# EAGLE design LorenzoSchematicnewtrace (EAGLE 8.7.1)
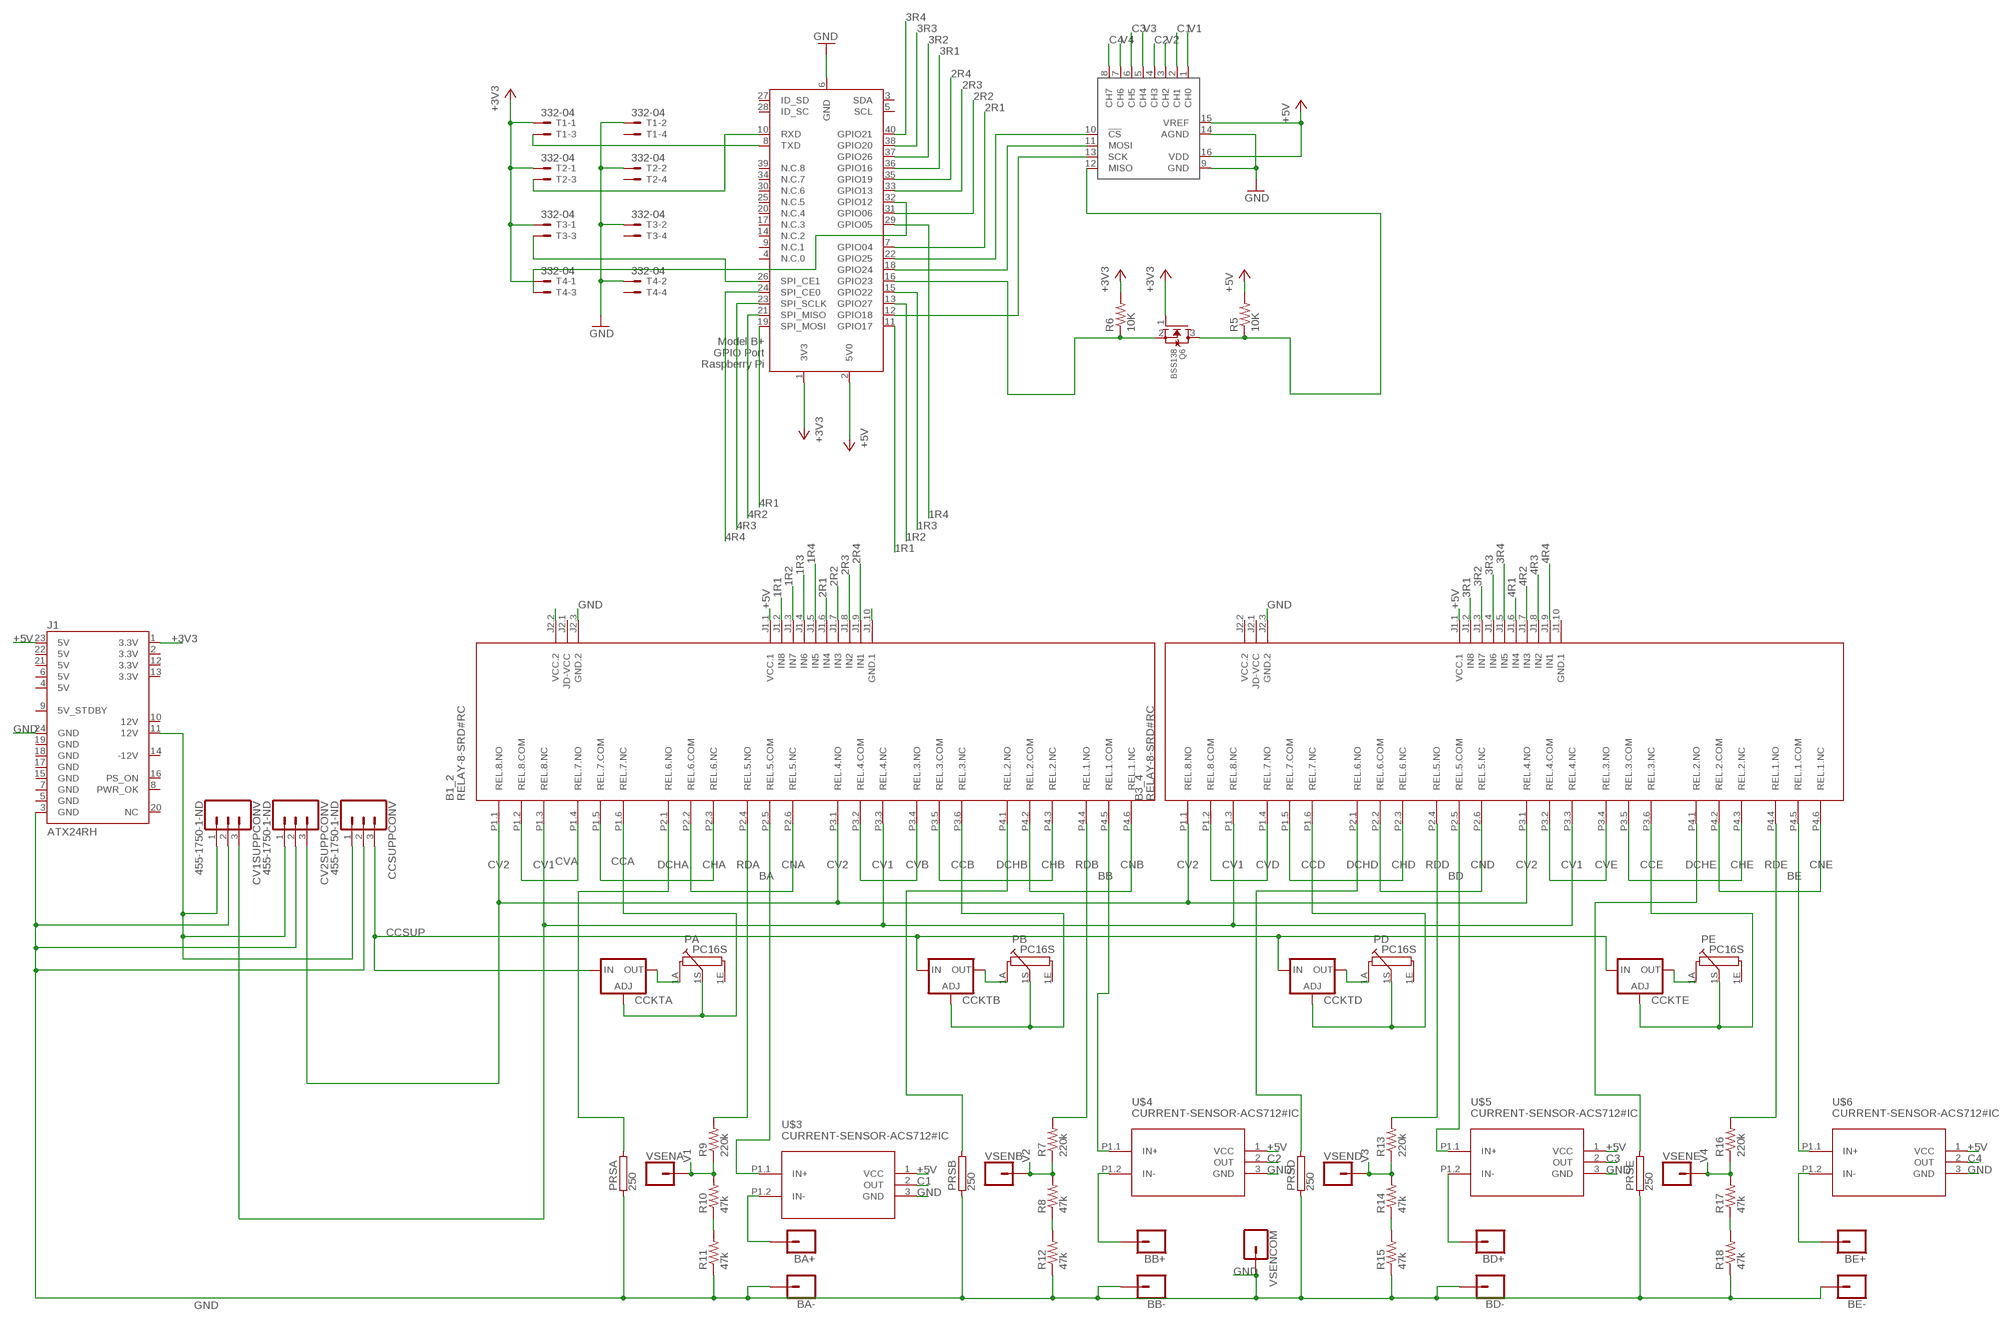
[diagram p0: schematic, sheet 1]

## Parts
ADC  MCP3008P  [DIL16]
B1_2  RELAY-8-SRD#RC  [RELAY-8-SRD#RC]
B3_4  RELAY-8-SRD#RC  [RELAY-8-SRD#RC]
BA+  CONN_01  [1X01]
BA-  CONN_01  [1X01]
BB+  CONN_01  [1X01]
BB-  CONN_01  [1X01]
BD+  CONN_01  [1X01]
BD-  CONN_01  [1X01]
BE+  CONN_01  [1X01]
BE-  CONN_01  [1X01]
CCKTA  LM317TL  [317TL]
CCKTB  LM317TL  [317TL]
CCKTD  LM317TL  [317TL]
CCKTE  LM317TL  [317TL]
CCSUPPCONV  455-1750-1-ND  CONN_03  [1X03]
CV1SUPPCONV  455-1750-1-ND  CONN_03  [1X03]
CV2SUPPCONV  455-1750-1-ND  CONN_03  [1X03]
J1  ATX24RH  [ATX24_RIGHT_ANGLE]
PA  PC16S  [PC16S]
PB  PC16S  [PC16S]
PD  PC16S  [PC16S]
PE  PC16S  [PC16S]
PRSA  250  RKH208-8  [KH208-8]
PRSB  250  RKH208-8  [KH208-8]
PRSD  250  RKH208-8  [KH208-8]
PRSE  250  RKH208-8  [KH208-8]
Q6  BSS138  MOSFET-NREFLOW  [SOT23]
R5  10K  R-US_R0805  [R0805]
R6  10K  R-US_R0805  [R0805]
R7  220k  R-US_0207/12  [0207/12]
R8  47k  R-US_0207/12  [0207/12]
R9  220k  R-US_0207/12  [0207/12]
R10  47k  R-US_0207/12  [0207/12]
R11  47k  R-US_0207/12  [0207/12]
R12  47k  R-US_0207/12  [0207/12]
R13  220k  R-US_0207/12  [0207/12]
R14  47k  R-US_0207/12  [0207/12]
R15  47k  R-US_0207/12  [0207/12]
R16  220k  R-US_0207/12  [0207/12]
R17  47k  R-US_0207/12  [0207/12]
R18  47k  R-US_0207/12  [0207/12]
T1  332-04  [332-04]
T2  332-04  [332-04]
T3  332-04  [332-04]
T4  332-04  [332-04]
U$3  CURRENT-SENSOR-ACS712#IC  [CURRENT-SENSOR-ACS712#IC]
U$4  CURRENT-SENSOR-ACS712#IC  [CURRENT-SENSOR-ACS712#IC]
U$5  CURRENT-SENSOR-ACS712#IC  [CURRENT-SENSOR-ACS712#IC]
U$6  CURRENT-SENSOR-ACS712#IC  [CURRENT-SENSOR-ACS712#IC]
VSENA  CONN_01  [1X01]
VSENB  CONN_01  [1X01]
VSENCOM  CONN_01  [1X01]
VSEND  CONN_01  [1X01]
VSENE  CONN_01  [1X01]
X2  RASPI_BOARD_B+_E4  [RASPI_BOARD_B+_EDGES_4DRILL]

## Nets
1R1: B1_2.J1.2(IN8) X2.11(GPIO17)
1R2: B1_2.J1.3(IN7) X2.13(GPIO27)
1R3: B1_2.J1.4(IN6) X2.15(GPIO22)
1R4: B1_2.J1.5(IN5) X2.29(GPIO05)
2R1: B1_2.J1.6(IN4) X2.7(GPIO04)
2R2: B1_2.J1.7(IN3) X2.31(GPIO06)
2R3: B1_2.J1.8(IN2) X2.33(GPIO13)
2R4: B1_2.J1.9(IN1) X2.35(GPIO19)
3R1: B3_4.J1.2(IN8) X2.36(GPIO16)
3R2: B3_4.J1.3(IN7) X2.37(GPIO26)
3R3: B3_4.J1.4(IN6) X2.38(GPIO20)
3R4: B3_4.J1.5(IN5) X2.40(GPIO21)
4R1: B3_4.J1.6(IN4) X2.19(SPI_MOSI)
4R2: B3_4.J1.7(IN3) X2.21(SPI_MISO)
4R3: B3_4.J1.8(IN2) X2.23(SPI_SCLK)
4R4: B3_4.J1.9(IN1) X2.24(SPI_CE0)
12V: CCSUPPCONV.1 CV1SUPPCONV.1 CV2SUPPCONV.1 J1.11(12V)
+3V3: J1.1(3.3V) Q6.1(G) R6.2 T1.1 T2.1 T3.1 T4.1 X2.1(3V3)
+5V: ADC.15(VREF) ADC.16(VDD) B1_2.J1.1(VCC.1) B3_4.J1.1(VCC.1) J1.23(5V) R5.2 U$3.1(VCC) U$4.1(VCC) U$5.1(VCC) U$6.1(VCC) X2.2(5V0)
BA: B1_2.P2.5(REL.5.COM) U$3.P1.1(IN+)
BB: B1_2.P4.5(REL.1.COM) U$4.P1.1(IN+)
BD: B3_4.P2.5(REL.5.COM) U$5.P1.1(IN+)
BE: B3_4.P4.5(REL.1.COM) U$6.P1.1(IN+)
C1: ADC.2(CH1) U$3.2(OUT)
C2: ADC.4(CH3) U$4.2(OUT)
C3: ADC.6(CH5) U$5.2(OUT)
C4: ADC.8(CH7) U$6.2(OUT)
CCA: B1_2.P1.6(REL.7.NC) CCKTA.1(ADJ) PA.1S
CCB: B1_2.P3.6(REL.3.NC) CCKTB.1(ADJ) PB.1S
CCD: B3_4.P1.6(REL.7.NC) CCKTD.1(ADJ) PD.1S
CCE: B3_4.P3.6(REL.3.NC) CCKTE.1(ADJ) PE.1S
CCSUP: CCKTA.3(IN) CCKTB.3(IN) CCKTD.3(IN) CCKTE.3(IN) CCSUPPCONV.3
CHA: B1_2.P1.5(REL.7.COM) B1_2.P2.3(REL.6.NC)
CHB: B1_2.P3.5(REL.3.COM) B1_2.P4.3(REL.2.NC)
CHD: B3_4.P1.5(REL.7.COM) B3_4.P2.3(REL.6.NC)
CHE: B3_4.P3.5(REL.3.COM) B3_4.P4.3(REL.2.NC)
CNA: B1_2.P2.2(REL.6.COM) B1_2.P2.6(REL.5.NC)
CNB: B1_2.P4.2(REL.2.COM) B1_2.P4.6(REL.1.NC)
CND: B3_4.P2.2(REL.6.COM) B3_4.P2.6(REL.5.NC)
CNE: B3_4.P4.2(REL.2.COM) B3_4.P4.6(REL.1.NC)
CV1: B1_2.P1.3(REL.8.NC) B1_2.P3.3(REL.4.NC) B3_4.P1.3(REL.8.NC) B3_4.P3.3(REL.4.NC) CV1SUPPCONV.3
CV2: B1_2.P1.1(REL.8.NO) B1_2.P3.1(REL.4.NO) B3_4.P1.1(REL.8.NO) B3_4.P3.1(REL.4.NO) CV2SUPPCONV.3
CVA: B1_2.P1.2(REL.8.COM) B1_2.P1.4(REL.7.NO)
CVB: B1_2.P3.2(REL.4.COM) B1_2.P3.4(REL.3.NO)
CVD: B3_4.P1.2(REL.8.COM) B3_4.P1.4(REL.7.NO)
CVE: B3_4.P3.2(REL.4.COM) B3_4.P3.4(REL.3.NO)
DCHA: B1_2.P2.1(REL.6.NO) PRSA.2
DCHB: B1_2.P4.1(REL.2.NO) PRSB.2
DCHD: B3_4.P2.1(REL.6.NO) PRSD.2
DCHE: B3_4.P4.1(REL.2.NO) PRSE.2
GND: ADC.9(GND) ADC.14(AGND) B1_2.J2.3(GND.2) B3_4.J2.3(GND.2) BA-.1 BB-.1 BD-.1 BE-.1 CCSUPPCONV.2 CV1SUPPCONV.2 CV2SUPPCONV.2 J1.3(GND) J1.24(GND) PRSA.1 PRSB.1 PRSD.1 PRSE.1 R11.1 R12.1 R15.1 R18.1 T1.2 T2.2 T3.2 T4.2 U$3.3(GND) U$4.3(GND) U$5.3(GND) U$6.3(GND) VSENCOM.1 X2.6(GND)
N$1: CCKTA.2(OUT) PA.1A
N$2: CCKTB.2(OUT) PB.1A
N$3: Q6.2(S) R6.1 X2.16(GPIO23)
N$4: R10.1 R11.2
N$6: R8.1 R12.2
N$8: CCKTD.2(OUT) PD.1A
N$9: R14.1 R15.2
N$11: CCKTE.2(OUT) PE.1A
N$12: R17.1 R18.2
N$14: ADC.12(MISO) Q6.3(D) R5.1
N$15: T1.3 X2.8(TXD)
N$16: ADC.13(SCK) X2.12(GPIO18)
N$17: ADC.11(MOSI) X2.18(GPIO24)
N$18: ADC.10(!CS) X2.22(GPIO25)
N$19: T2.3 X2.10(RXD)
N$20: T3.3 X2.26(SPI_CE1)
N$21: T4.3 X2.32(GPIO12)
N$22: BB+.1 U$4.P1.2(IN-)
N$23: BA+.1 U$3.P1.2(IN-)
N$24: BD+.1 U$5.P1.2(IN-)
N$25: BE+.1 U$6.P1.2(IN-)
N$26: B1_2.J2.2(VCC.2)
N$27: B1_2.J1.10(GND.1)
RDA: B1_2.P2.4(REL.5.NO) R9.2
RDB: B1_2.P4.4(REL.1.NO) R7.2
RDD: B3_4.P2.4(REL.5.NO) R13.2
RDE: B3_4.P4.4(REL.1.NO) R16.2
V1: ADC.1(CH0) R9.1 R10.2 VSENA.1
V2: ADC.3(CH2) R7.1 R8.2 VSENB.1
V3: ADC.5(CH4) R13.1 R14.2 VSEND.1
V4: ADC.7(CH6) R16.1 R17.2 VSENE.1
Unconnected: B1_2.J2.1(JD-VCC) B3_4.J2.1(JD-VCC) J1.2(3.3V) J1.4(5V) J1.5(GND) J1.6(5V) J1.7(GND) J1.8(PWR_OK) J1.9(5V_STDBY) J1.10(12V) J1.12(3.3V) J1.13(3.3V) J1.14(-12V) J1.15(GND) J1.16(PS_ON) J1.17(GND) J1.18(GND) J1.19(GND) J1.20(NC) J1.21(5V) J1.22(5V) PA.1E PB.1E PD.1E PE.1E T1.4 T2.4 T3.4 T4.4 X2.3(SDA) X2.4(N.C.0) X2.5(SCL) X2.9(N.C.1) X2.14(N.C.2) X2.17(N.C.3) X2.20(N.C.4) X2.25(N.C.5) X2.27(ID_SD) X2.28(ID_SC) X2.30(N.C.6) X2.34(N.C.7) X2.39(N.C.8)

## Power pins joined to a net without a drawn wire
GND.1: B3_4.J1.10(GND.1)
VCC.2: B3_4.J2.2(VCC.2)

## Library data of the parts
ADC = MCP3008:MCP3008
B1_2 B3_4 = diy-modules:RELAY-8-SRD#RC: 8-Channel Relay Module based on SRD-05VDC-SL-C relays Symbol with relays pins Click here to find device on ebay.com <http://www.ebay.com/sch/eight+channel+relay+module+optocoupler+5v>
BA+ BA- BB+ BB- BD+ BD- BE+ BE- VSENA VSENB VSENCOM VSEND VSENE = SparkFun-Connectors:CONN_01: Single connection point. Often used as Generic Header-pin footprint for 0.1 inch spaced/style header connections On any of the 0.1 inch spaced packages, you can populate with these: Break Away Headers - Straight <https://www.sparkfun.com/products/116> (PRT-00116) Break Away Male Headers - Right Angle <https://www.sparkfun.com/products/553> (PRT-00553) Female Headers <https://www.sparkfun.com/products/115> (PRT-00115) Break Away Headers - Machine Pin <https://www.sparkfun.com/products/117> (PRT-00117) Break Away Female Headers - Swiss Machine Pin <https://www.sparkfun.com/products/743> (PRT-00743) This device is also useful as a general connection point to wire up your design to another part of your project. Our various solder wires solder well into these plated through hole pads. Hook-Up Wire - Assortment (Stranded, 22 AWG) <https://www.sparkfun.com/products/11375> (PRT-11375) Hook-Up Wire - Assortment (Solid Core, 22 AWG) <https://www.sparkfun.com/products/11367> (PRT-11367) View the entire wire category on our website here <https://www.sparkfun.com/categories/141> Special notes: SMTSO-256-ET is a "flush mount" nut for a 4-40 screw. We mostly use this on specialty testbeds; it is a nice way to connect hardware to your PCB at an adjustable hieght. Also note, the SNAP packages are for using a snappable style connector. We sell a baggie of snaps and they are also used on two LilyPad designs: Snap Assortment - 30 pack (male and female) <https://www.sparkfun.com/products/11347> (DEV-11347) LilyPad Arduino SimpleSnap <https://www.sparkfun.com/products/10941> (DEV-10941) LilyPad SimpleSnap Protoboard <https://www.sparkfun.com/products/10940> (DEV-10940)
CCKTA CCKTB CCKTD CCKTE = v-reg:LM317TL: VOLTAGE REGULATOR
CCSUPPCONV CV1SUPPCONV CV2SUPPCONV = SparkFun-Connectors:CONN_03: Multi connection point. Often used as Generic Header-pin footprint for 0.1 inch spaced/style header connections On any of the 0.1 inch spaced packages, you can populate with these: Break Away Headers - Straight <https://www.sparkfun.com/products/116> (PRT-00116) Break Away Male Headers - Right Angle <https://www.sparkfun.com/products/553> (PRT-00553) Female Headers <https://www.sparkfun.com/products/115> (PRT-00115) Break Away Headers - Machine Pin <https://www.sparkfun.com/products/117> (PRT-00117) Break Away Female Headers - Swiss Machine Pin <https://www.sparkfun.com/products/743> (PRT-00743) Stackable Header - 3 Pin (Female, 0.1") <https://www.sparkfun.com/products/13875> (PRT-13875) For SCREWTERMINALS and SPRING TERMINALS visit here: Screw Terimnals on SparkFun.com <https://www.sparkfun.com/search/results?term=Screw+Terminals> (5mm/3.5mm/2.54mm spacing) This device is also useful as a general connection point to wire up your design to another part of your project. Our various solder wires solder well into these plated through hole pads. Hook-Up Wire - Assortment (Stranded, 22 AWG) <https://www.sparkfun.com/products/11375> (PRT-11375) Hook-Up Wire - Assortment (Solid Core, 22 AWG) <https://www.sparkfun.com/products/11367> (PRT-11367) View the entire wire category on our website here <https://www.sparkfun.com/categories/141> Special notes: Molex polarized connector foot print use with SKU : PRT-08232 with associated crimp pins and housings.; PROD_ID: XXX-00000
J1 = SparkFun-Connectors:ATX24: ATX24 Pin Power Supply Connector - Right Angle PTH Mount This is a good connector for connecting a computer power supply to a PCB. It's massive, but provides many amps of power at 5V and 12V. SparkFun Products: SparkFun Benchtop Power Board Kit <https://www.sparkfun.com/products/12867> SparkFun Power Driver Shield Kit <https://www.sparkfun.com/products/10618>; PROD_ID: CONN-09674; SF_ID: PRT-09498
PA PB PD PE = piher:PC16S: POTENTIOMETER single carbon potentiometer, 16 mm, S3ROH; OC_FARNELL: 4452940; OC_NEWARK: unknown
PRSA PRSB PRSD PRSE = resistor-power:R: Power Resitor; OC_FARNELL: unknown; OC_NEWARK: unknown
Q6 = adafruit:MOSFET-N: N-Channel Mosfet 2N7002E - 60V 260mA SOT23 [Digikey: 2N7002ET1GOSTR-ND] - REEL BSH103 - 30V 850mA SOT23 [Digikey: 568-5013-1-ND]
R5 R6 = adafruit:R-US_: RESISTOR, American symbol
R7-R18 = resistor:R-US_: RESISTOR, American symbol
T1-T4 = con-garry:332-04: 4 Pin - 2mm Dual Row Source: www.mpe-connector.de / garry_shortform_2012.pdf
U$3-U$6 = diy-modules:CURRENT-SENSOR-ACS712#IC: Isolated Bipolar Current Sensors based on ACS712 chip Symbol with input pins More details available here: http://embedded-lab.com/blog/a-brief-overview-of-allegro-acs712-current-sensor-part-1/ Click here to find device on ebay.com <http://www.ebay.com/sch/acs712+module> Note: There are many available versions with different pinout. Please check before use
X2 = raspberrypi_bastelstube_v13:RASPI_BOARD_B+: Raspberry Pi GPIO connector with markings for the outer dimensions of the Raspberry Pi board model B+ with different sets of drill holes or mounting pads

## Board
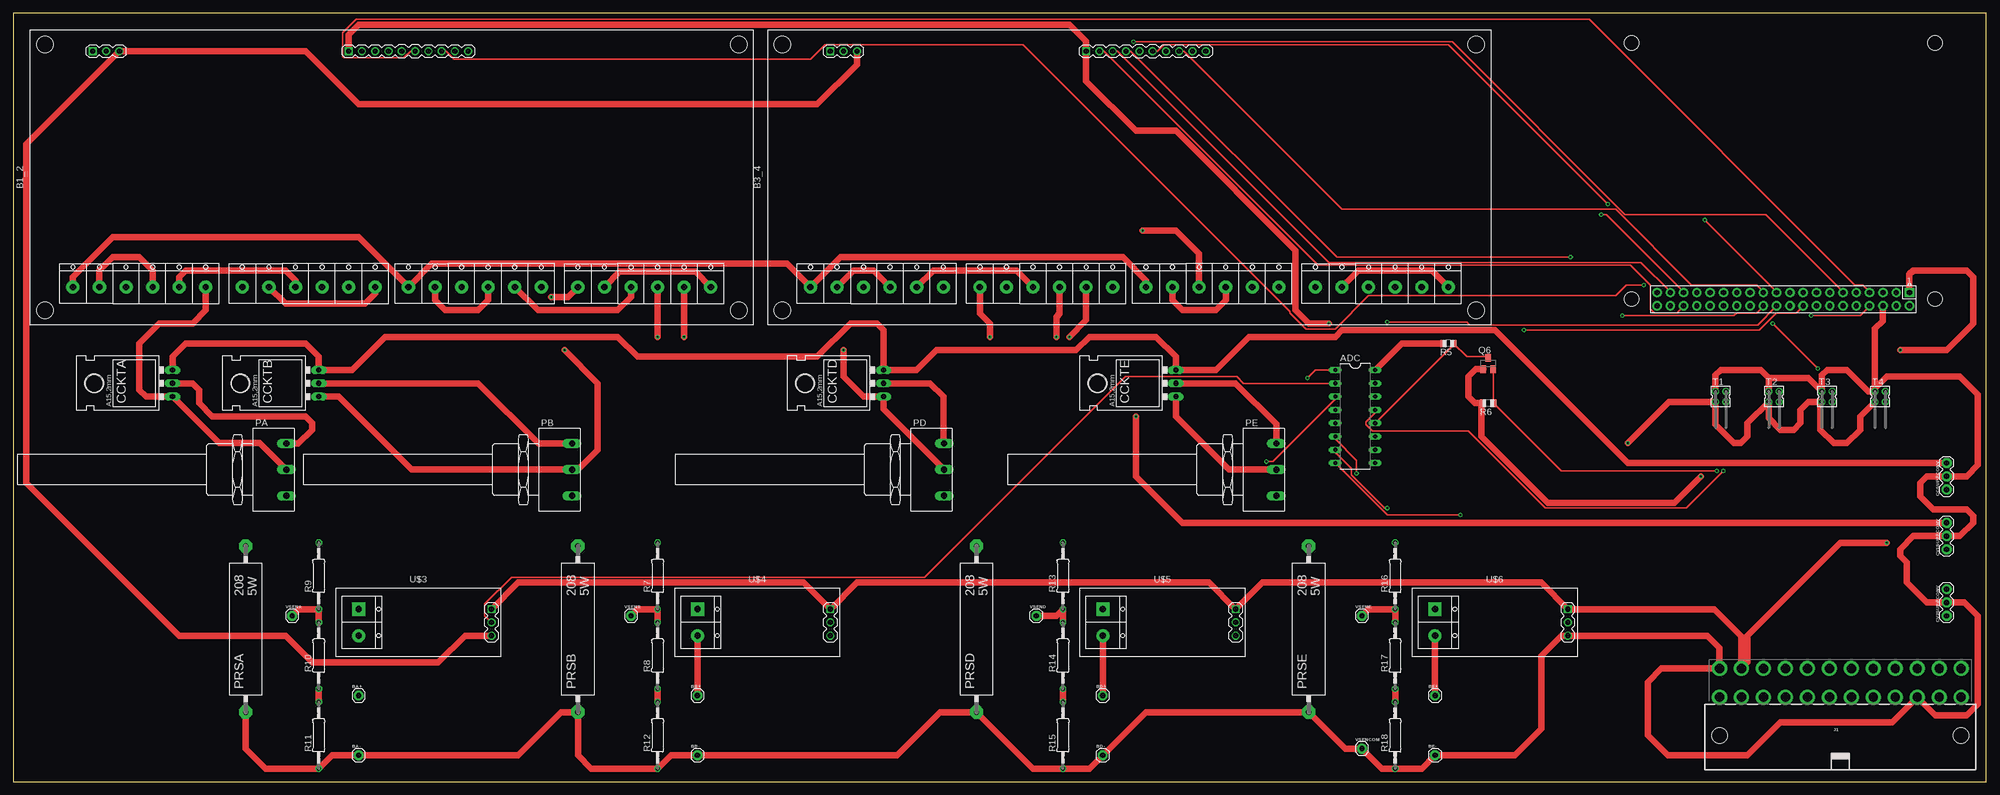
[diagram p1: board, top side]
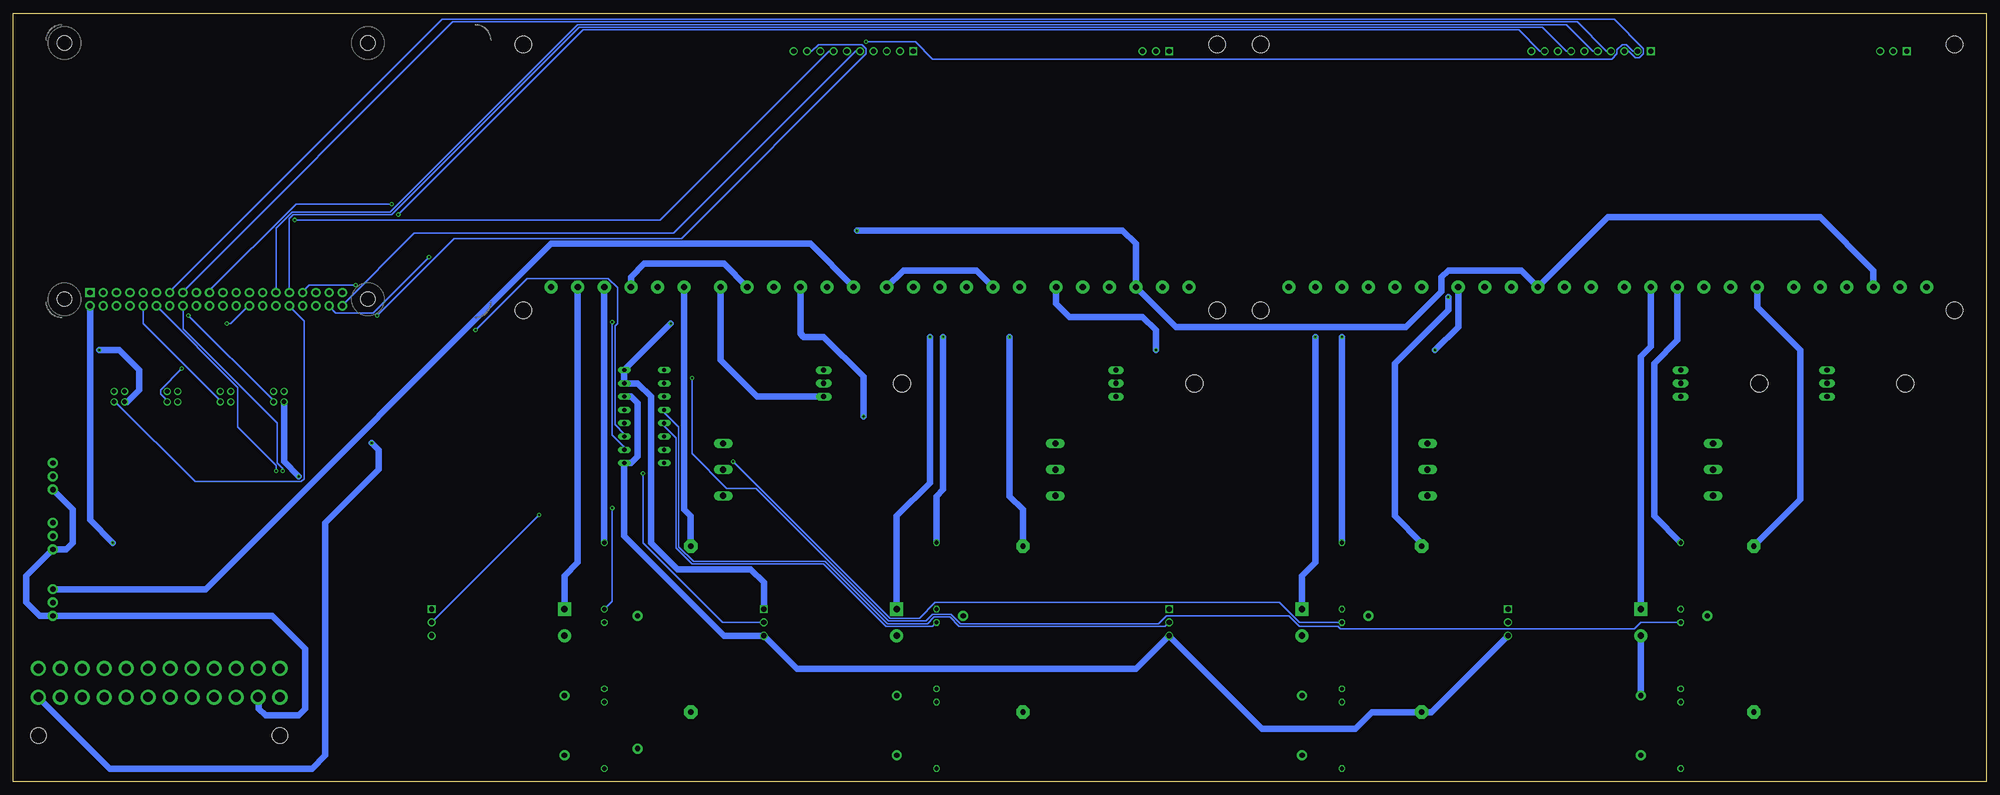
[diagram p2: board, bottom side, seen from below]

Size 377.17 x 146.99 mm. Coordinates in mm from the lower left corner, seen from the top.
Outline: 0,0 377.17,0 377.17,146.99 0,146.99 0,0
Copper layers (1*16): Top 0.035mm / dielectric 1.5mm / Bottom 0.035mm
Design rules "Standard": minimum track width 10mil, minimum drill 15mil, track to track 10mil, track to pad 10mil, pad to pad 10mil, via to via 10mil, smd to smd 10mil, copper to edge 40mil, drill to drill 10mil, minimum pad ring 8mil, minimum via ring 8mil, stop-mask expansion 4mil, vias tented up to drill 0mil, thermal gap 10mil

### Footprints (pad centres in the part's own frame; a part is rotated, then mirrored left to right if it is on the bottom)
DIL16 = drill 0.813 long: 1 -8.89,-3.81; 2 -6.35,-3.81; 3 -3.81,-3.81; 4 -1.27,-3.81; 5 1.27,-3.81; 6 3.81,-3.81; 7 6.35,-3.81; 8 8.89,-3.81; 9 8.89,3.81; 10 6.35,3.81; 11 3.81,3.81; 12 1.27,3.81; 13 -1.27,3.81; 14 -3.81,3.81; 15 -6.35,3.81; 16 -8.89,3.81
RELAY-8-SRD#RC = drill 1 square: J1.1 24.13,8.255; J2.1 24.13,57.15 | drill 1: J1.2 24.13,5.715; J1.3 24.13,3.175; J1.4 24.13,0.635; J1.5 24.13,-1.905; J1.6 24.13,-4.445; J1.7 24.13,-6.985; J1.8 24.13,-9.525; J1.9 24.13,-12.065; J1.10 24.13,-14.605; J2.2 24.13,54.61; J2.3 24.13,52.07 | drill 1.2 pad 2.5: P1.1 -20.955,60.96; P1.2 -20.955,55.88; P1.3 -20.955,50.8; P1.4 -20.955,45.72; P1.5 -20.955,40.64; P1.6 -20.955,35.56; P2.1 -20.955,28.575; P2.2 -20.955,23.495; P2.3 -20.955,18.415; P2.4 -20.955,13.335; P2.5 -20.955,8.255; P2.6 -20.955,3.175; P3.1 -20.955,-3.175; P3.2 -20.955,-8.255; P3.3 -20.955,-13.335; P3.4 -20.955,-18.415; P3.5 -20.955,-23.495; P3.6 -20.955,-28.575; P4.1 -20.955,-35.56; P4.2 -20.955,-40.64; P4.3 -20.955,-45.72; P4.4 -20.955,-50.8; P4.5 -20.955,-55.88; P4.6 -20.955,-60.96 | hole 3.2: -25.4,66.294; 25.4,66.294; 25.4,-66.294; -25.4,-66.294
1X01 = drill 1.016 pad 1.88: 1 0,0
317TL = drill 1.016 long: 1 -2.54,-3.81; 2 0,-3.81; 3 2.54,-3.81 | hole 3.302: 0,11.176
1X03 = drill 1.016 pad 1.88: 1 0,0; 2 2.54,0; 3 5.08,0
ATX24_RIGHT_ANGLE = drill 1.8 pad 2.9: 1 23.1,4.76; 2 18.9,4.76; 3 14.7,4.76; 4 10.5,4.76; 5 6.3,4.76; 6 2.1,4.76; 7 -2.1,4.76; 8 -6.3,4.76; 9 -10.5,4.76; 10 -14.7,4.76; 11 -18.9,4.76; 12 -23.1,4.76; 13 23.1,10.26; 14 18.9,10.26; 15 14.7,10.26; 16 10.5,10.26; 17 6.3,10.26; 18 2.1,10.26; 19 -2.1,10.26; 20 -6.3,10.26; 21 -10.5,10.26; 22 -14.7,10.26; 23 -18.9,10.26; 24 -23.1,10.26 | hole 3: -23.1,-2.54; 23.1,-2.54
PC16S = drill 1.2 long: 1A -5,6.5; 1E 5,6.5; 1S 0,6.5
KH208-8 = drill 1.016 pad 2.54 octagon: 1 -15.875,0; 2 15.875,0
SOT23 = smd 1 x 1.4: 1 -0.95,-1.1; 2 0.95,-1.1; 3 0,1.1
R0805 = smd 1.1 x 1.4: 1 -1,0; 2 1,0
0207/12 = drill 0.813 octagon: 1 -6.35,0; 2 6.35,0
332-04 = drill 0.9 pad 1.27: 1 -1,-1; 2 -1,1; 3 1,-1; 4 1,1
CURRENT-SENSOR-ACS712#IC = drill 1 square: 1 13.97,2.54 | drill 1: 2 13.97,0; 3 13.97,-2.54 | drill 1.2 pad 2.5 square: P1.1 -11.43,2.54 | drill 1.2 pad 2.5: P1.2 -11.43,-2.54
RASPI_BOARD_B+_EDGES_4DRILL = drill 1 pad 1.778 square: 1 8.37,51.23 | drill 1 pad 1.778: 2 8.37,53.77; 3 10.91,51.23; 4 10.91,53.77; 5 13.45,51.23; 6 13.45,53.77; 7 15.99,51.23; 8 15.99,53.77; 9 18.53,51.23; 10 18.53,53.77; 11 21.07,51.23; 12 21.07,53.77; 13 23.61,51.23; 14 23.61,53.77; 15 26.15,51.23; 16 26.15,53.77; 17 28.69,51.23; 18 28.69,53.77; 19 31.23,51.23; 20 31.23,53.77; 21 33.77,51.23; 22 33.77,53.77; 23 36.31,51.23; 24 36.31,53.77; 25 38.85,51.23; 26 38.85,53.77; 27 41.39,51.23; 28 41.39,53.77; 29 43.93,51.23; 30 43.93,53.77; 31 46.47,51.23; 32 46.47,53.77; 33 49.01,51.23; 34 49.01,53.77; 35 51.55,51.23; 36 51.55,53.77; 37 54.09,51.23; 38 54.09,53.77; 39 56.63,51.23; 40 56.63,53.77 | hole 2.75: 3.5,3.5; 3.5,52.5; 61.5,3.5; 61.5,52.5

### Placement (x,y rotation side)
ADC  256.54,69.85 270 top
B1_2  72.39,115.57 90 top
B3_4  213.36,115.57 90 top
BA+  66.04,16.51 0 top
BA-  66.04,5.08 0 top
BB+  130.81,16.51 0 top
BB-  130.81,5.08 0 top
BD+  208.28,16.51 0 top
BD-  208.28,5.08 0 top
BE+  271.78,16.51 0 top
BE-  271.78,5.08 0 top
CCKTA  26.67,76.2 90 top
CCKTB  54.61,76.2 90 top
CCKTD  162.56,76.2 90 top
CCKTE  218.44,76.2 90 top
CCSUPPCONV  369.57,55.88 90 top
CV1SUPPCONV  369.57,44.45 90 top
CV2SUPPCONV  369.57,31.75 90 top
J1  349.25,11.43 0 top
PA  45.72,59.69 270 top
PB  100.33,59.69 270 top
PD  171.45,59.69 270 top
PE  234.95,59.69 270 top
PRSA  44.45,29.21 90 top
PRSB  107.95,29.21 90 top
PRSD  184.15,29.21 90 top
PRSE  247.65,29.21 90 top
Q6  281.94,80.01 0 top
R5  274.32,83.82 180 top
R6  281.94,72.39 180 top
R7  123.19,39.37 90 top
R8  123.19,24.13 90 top
R9  58.42,39.37 90 top
R10  58.42,24.13 90 top
R11  58.42,8.89 90 top
R12  123.19,8.89 90 top
R13  200.66,39.37 90 top
R14  200.66,24.13 90 top
R15  200.66,8.89 90 top
R16  264.16,39.37 90 top
R17  264.16,24.13 90 top
R18  264.16,8.89 90 top
T1  326.39,73.66 0 top
T2  336.55,73.66 0 top
T3  346.71,73.66 0 top
T4  356.87,73.66 0 top
U$3  77.47,30.48 0 top
U$4  142.24,30.48 0 top
U$5  219.71,30.48 0 top
U$6  283.21,30.48 0 top
VSENA  53.34,31.75 0 top
VSENB  118.11,31.75 0 top
VSENCOM  257.81,6.35 0 top
VSEND  195.58,31.75 0 top
VSENE  257.81,31.75 0 top
X2  370.84,144.78 180 top

### Tracks (layer width: path | path; a pad name or v marks a point on that pad's centre or on a via)
1R1  (via drill 0.38)
  Top 0.254: v214.12,141.48 275.08,141.48 308.1,108.46 335.03,108.46 349.76,93.73 X2.11
  Bottom 0.254: B1_2.J1.2 67.56,139.7 68.83,140.97 69.6,140.97 70.61,139.95 70.61,139.19 71.63,138.18 201.42,138.18 204.72,141.48 v214.12,141.48
1R2
  Bottom 0.254: B1_2.J1.3 68.33,139.7 67.06,138.43 66.29,138.43 65.53,139.19 65.53,140.21 71.12,145.8 295.15,145.8 347.22,93.73 X2.13
1R3
  Bottom 0.254: B1_2.J1.4 72.64,139.7 78.23,145.29 293.12,145.29 344.68,93.73 X2.15
1R4
  Bottom 0.254: B1_2.J1.5 75.18,139.7 80.26,144.78 269.24,144.78 305.05,108.97 323.85,108.97 326.9,105.92 326.9,93.73 X2.29
2R1
  Top 0.254: B1_2.J1.6 75.95,139.7 74.68,138.43 63.25,138.43 62.99,138.68 62.99,143.26 65.53,145.8 301.24,145.8 352.04,95 353.57,95 354.84,93.73 X2.7
2R2
  Bottom 0.254: B1_2.J1.7 80.26,139.7 84.84,144.27 268.99,144.27 304.8,108.46 323.6,108.46 324.36,107.7 324.36,93.73 X2.31
2R3  (via drill 0.38)
  Top 0.254: B1_2.J1.8 82.8,139.7 84.33,138.18 152.4,138.18 155.19,140.97 193.04,140.97 244.09,89.92 244.09,89.66 247.14,86.61 252.73,86.61 259.08,92.96 306.32,92.96 308.36,95 v311.66,95
  Bottom 0.254: v311.66,95 320.55,95 321.82,93.73 X2.33
2R4  (via drill 0.38)
  Top 0.254: v303.53,108.46 304.55,108.46 319.28,93.73 X2.35
  Bottom 0.254: B1_2.J1.9 85.34,139.7 89.41,143.76 268.22,143.76 v303.53,108.46
3R1
  Top 0.254: B3_4.J1.2 208.53,139.7 249.43,98.81 309.12,98.81 312.93,95 312.93,90.42 313.69,89.66 318.01,89.66 319.28,90.93 X2.36
3R2
  Top 0.254: B3_4.J1.3 211.07,139.7 251.46,99.31 311.15,99.31 316.74,93.73 X2.37
3R3  (via drill 0.38)
  Top 0.254: B3_4.J1.4 213.61,139.7 252.98,100.33 v297.69,100.33
  Bottom 0.254: v297.69,100.33 308.36,89.66 315.47,89.66 316.74,90.93 X2.38
3R4
  Bottom 0.254: B3_4.J1.5 216.15,139.7 250.95,104.9 300.48,104.9 314.2,91.19 X2.40
4R1  (via drill 0.38)
  Top 0.254: B3_4.J1.6 218.69,139.7 219.96,140.97 274.32,140.97 v304.8,110.49
  Bottom 0.254: v304.8,110.49 323.09,110.49 339.85,93.73 X2.19
4R2  (via drill 0.38)
  Top 0.254: v323.34,107.44 337.06,93.73 X2.21
  Bottom 0.254: B3_4.J1.7 221.23,139.7 253.49,107.44 v323.34,107.44
4R3
  Top 0.254: B3_4.J1.8 223.77,139.7 254,109.47 306.32,109.47 320.8,95 333.25,95 334.52,93.73 X2.23
4R4  (via drill 0.38)
  Top 0.254: v307.59,89.15 328.93,89.15 329.44,89.66 333.25,89.66 334.52,90.93 X2.24
  Bottom 0.254: B3_4.J1.9 224.54,139.7 223.27,140.97 214.88,140.97 214.12,140.21 214.12,139.19 249.43,103.89 292.86,103.89 v307.59,89.15
12V
  Bottom 1.27: J1.11 330.2,16.04 330.2,13.97 328.93,12.7 322.58,12.7 321.31,13.97 321.31,25.4 327.66,31.75 CV2SUPPCONV.1 372.11,31.75 374.65,34.29 374.65,39.37 CV1SUPPCONV.1 367.03,44.45 365.76,45.72 365.76,52.07 CCSUPPCONV.1
+3V3  (via drill 0.35)
  Top 1.27: v308.61,64.77 316.5,72.66 T1.1 325.39,68.31 328.93,64.77 330.2,64.77 331.47,66.04 331.47,68.58 T2.1 335.55,69.58 337.82,67.31 340.36,67.31 341.63,68.58 341.63,71.12 343.17,72.66 T3.1 345.44,72.39 345.44,67.31 347.98,64.77 350.52,64.77 353.06,67.31 353.06,69.85 T4.1 | v322.58,58.42 317.5,53.34 293.37,53.34 280.67,66.04 280.67,72.12 R6.2 279.4,72.39 278.13,73.66 278.13,77.47 279.57,78.91 Q6.1 | X2.1 362.47,97.04 363.22,97.79 373.38,97.79 374.65,96.52 374.65,87.63 369.57,82.55 v360.68,82.55
  Bottom 1.27: v308.61,64.77 307.34,63.5 307.34,59.69 317.5,49.53 317.5,5.08 320.04,2.54 358.7,2.54 J1.1 | T1.1 325.39,61.23 v322.58,58.42 | T4.1 355.33,72.66 353.06,74.93 353.06,78.74 356.87,82.55 v360.68,82.55
+5V  (via drill 0.35)
  Top 1.27: B1_2.J1.1 64.14,142.88 66.04,144.78 201.93,144.78 205.1,141.6 B3_4.J1.1 205.1,133.99 214.63,124.46 222.25,124.46 245.11,101.6 245.11,90.17 247.65,87.63 v251.46,87.63 | U$3.1 96.52,38.1 151.13,38.1 U$4.1 161.29,38.1 228.6,38.1 U$5.1 238.76,38.1 292.1,38.1 U$6.1 325.12,33.02 330.35,27.79 J1.23 331.47,22.81 331.47,27.94 349.25,45.72 v358.14,45.72 | ADC.16 265.43,83.82 R5.2
  Bottom 1.27: v251.46,87.63 ADC.16 ADC.15 257.81,76.2 255.27,73.66 255.27,45.72 250.19,40.64 236.22,40.64 233.68,38.1 U$5.1 | v358.14,45.72 362.47,50.05 X2.2
BA
  Bottom 1.27: B1_2.P2.5 64.14,83.19 66.04,81.28 U$3.P1.1
BB  (via drill 0.35)
  Top 1.27: B1_2.P4.5 v128.27,85.09
  Bottom 1.27: v128.27,85.09 128.27,41.91 130.81,39.37 U$4.P1.1
BD  (via drill 0.35)
  Top 1.27: B3_4.P2.5 205.1,88.27 v201.93,85.09
  Bottom 1.27: v201.93,85.09 201.93,57.15 208.28,50.8 U$5.P1.1
BE
  Bottom 1.27: B3_4.P4.5 269.24,41.91 271.78,39.37 U$6.P1.1
C1
  Top 0.254: ADC.2 235.2,76.2 233.93,77.47 212.6,77.47 174.24,39.12 95.25,39.12 90.17,34.04 90.17,31.75 U$3.2
C2
  Bottom 0.254: ADC.4 252.73,70.61 249.94,67.82 249.94,44.96 247.14,42.16 222,42.16 210.06,30.23 202.44,30.23 201.17,31.5 198.12,31.5 196.34,29.72 156.97,29.72 U$4.2
C3  (via drill 0.38)
  Top 0.254: ADC.6 252.73,65.53 256.79,61.47 v256.79,58.93
  Bottom 0.254: v256.79,58.93 256.79,45.72 241.55,30.48 U$5.2
C4  (via drill 0.38)
  Top 0.254: ADC.8 262.64,51.05 v276.61,51.05
  Bottom 0.254: U$6.2 v276.61,51.05
CCA
  Top 1.27: CCKTA.1 30.48,73.86 | B1_2.P1.6 36.83,90.17 34.29,87.63 27.94,87.63 24.13,83.82 24.13,74.93 25.4,73.66 CCKTA.1 | PA.1S 47.14,64.77 39.37,64.77 CCKTA.1
CCB  (via drill 0.35)
  Top 1.27: CCKTB.1 62.23,73.66 76.2,59.69 PB.1S 107.95,59.69 111.76,63.5 111.76,76.2 v105.41,82.55
  Bottom 1.27: v105.41,82.55 100.97,87 B1_2.P3.6
CCD  (via drill 0.35)
  Top 1.27: PD.1S 166.37,71.27 CCKTD.1 162.56,73.66 158.75,77.47 v158.75,82.55
  Bottom 1.27: v158.75,82.55 158.75,86.36 161.29,88.9 175.26,88.9 177.8,91.44 B3_4.P1.6
CCE
  Top 1.27: PE.1S 232.41,59.69 222.25,69.85 CCKTE.1
  Bottom 1.27: CCKTE.1 234.95,73.66 241.94,80.64 B3_4.P3.6
CCSUP
  Top 1.27: 58.42,80.01 CCKTB.3 | CCKTB.3 58.42,81.28 55.88,83.82 33.02,83.82 30.48,81.28 CCKTA.3 | CCKTB.3 64.77,78.74 71.12,85.09 115.57,85.09 119.38,81.28 153.67,81.28 160.02,87.63 165.1,87.63 166.37,86.36 CCKTD.3 172.72,78.74 176.53,82.55 203.2,82.55 205.74,85.09 218.44,85.09 222.25,81.28 CCKTE.3 229.87,78.74 236.22,85.09 252.73,85.09 254,86.36 283.21,86.36 308.61,60.96 CCSUPPCONV.3
CHA
  Top 1.27: B1_2.P1.5 31.75,96.52 33.02,97.79 52.07,97.79 53.98,95.89 B1_2.P2.3
CHB
  Top 1.27: B1_2.P3.5 100.33,90.17 115.57,90.17 118.11,92.71 B1_2.P4.3
CHD
  Top 1.27: B3_4.P1.5 175.9,97.79 191.77,97.79 B3_4.P2.3
CHE
  Bottom 1.27: B3_4.P3.5 241.3,99.06 256.54,99.06 259.08,96.52 B3_4.P4.3
CNA
  Top 1.27: B1_2.P2.2 52.07,91.44 67.31,91.44 69.22,93.34 B1_2.P2.6
CNB
  Top 1.27: B1_2.P4.2 115.95,97.54 130.43,97.54 B1_2.P4.6
CND
  Bottom 1.27: B3_4.P2.2 193.04,97.79 207.01,97.79 B3_4.P2.6
CNE
  Top 1.27: B3_4.P4.2 257.18,97.79 271.14,97.79 B3_4.P4.6
CV1  (via drill 0.35)
  Top 1.27: v215.9,105.41 222.25,105.41 226.69,100.97 B3_4.P3.3 | v214.63,69.85 214.63,58.42 223.52,49.53 CV1SUPPCONV.3
  Bottom 1.27: 162.56,93.98 B3_4.P1.3 | B1_2.P1.3 21.59,97.79 31.75,107.95 72.39,107.95 B1_2.P3.3 88.9,97.79 102.87,97.79 104.14,96.52 104.14,93.71 110.93,86.92 154.86,86.92 B3_4.P1.3 | B3_4.P1.3 162.56,102.87 165.1,105.41 v215.9,105.41 | v214.63,69.85 214.63,77.47 222.25,85.09 226.06,85.09 226.69,85.72 B3_4.P3.3
CV2
  Top 1.27: B3_4.P3.1 216.53,95.89 212.09,100.33 158.12,100.33 B3_4.P1.1 147.96,99.06 80.01,99.06 B1_2.P3.1 66.04,104.14 19.05,104.14 11.43,96.52 B1_2.P1.1
  Bottom 1.27: CV2SUPPCONV.3 340.36,36.83 274.32,102.87 224.79,102.87 B3_4.P3.1
CVA
  Top 1.27: B1_2.P1.2 16.51,97.79 19.05,100.33 24.13,100.33 26.67,97.79 B1_2.P1.4
CVB
  Top 1.27: B1_2.P3.2 80.64,92.08 82.55,90.17 88.9,90.17 90.81,92.08 B1_2.P3.4
CVD
  Top 1.27: B3_4.P1.2 160.66,97.79 164.47,97.79 B3_4.P1.4
CVE
  Top 1.27: B3_4.P3.2 221.62,92.08 223.52,90.17 229.87,90.17 231.78,92.08 B3_4.P3.4
DCHA
  Bottom 1.27: B1_2.P2.1 43.81,90.81 35.56,82.55 35.56,53.98 PRSA.2
DCHB  (via drill 0.35)
  Top 1.27: v102.87,92.71 106.05,92.71 B1_2.P4.1
  Bottom 1.27: PRSB.2 107.95,45.72 113.03,50.8 113.03,80.01 102.87,90.17 v102.87,92.71
DCHD  (via drill 0.35)
  Top 1.27: B3_4.P2.1 184.78,89.53 186.69,87.63 v186.69,85.09
  Bottom 1.27: v186.69,85.09 186.69,54.61 184.15,52.07 PRSD.2
DCHE
  Bottom 1.27: B3_4.P4.1 248.92,52.07 247.65,50.8 PRSE.2
GND
  Top 1.27: B3_4.J2.3 161.29,137.16 153.67,129.54 66.04,129.54 55.88,139.7 B1_2.J2.3 2.54,121.92 2.54,57.15 31.75,27.94 52.07,27.94 57.15,22.86 81.28,22.86 86.36,27.94 U$3.3 | PRSA.1 44.45,6.35 48.26,2.54 R11.1 60.96,5.08 BA-.1 96.52,5.08 104.78,13.34 PRSB.1 107.95,5.08 110.49,2.54 R12.1 125.73,5.08 BB-.1 168.91,5.08 177.16,13.34 PRSD.1 194.94,2.54 R15.1 205.74,2.54 BD-.1 216.53,13.34 PRSE.1 254.63,6.35 VSENCOM.1 261.62,2.54 R18.1 269.24,2.54 BE-.1 287.02,5.08 292.1,10.16 292.1,24.13 295.91,27.94 U$6.3 323.85,27.94 326.15,25.64 J1.24 315.06,21.69 312.42,19.05 312.42,8.89 316.23,5.08 331.47,5.08 337.82,11.43 359.19,11.43 J1.3 367.44,12.7 373.38,12.7 375.52,14.84 375.52,31.75 372.98,34.29 CV2SUPPCONV.2 365.76,34.29 361.95,38.1 361.95,41.91 360.68,43.18 360.68,44.45 363.22,46.99 CV1SUPPCONV.2 372.11,46.99 374.65,49.53 374.65,50.8 373.38,52.07 367.03,52.07 364.49,54.61 364.49,57.15 365.76,58.42 CCSUPPCONV.2 373.38,58.42 375.52,60.56 375.52,74.06 372.11,77.47 358.14,77.47 355.87,75.2 T4.2 | X2.6 357.39,88.15 355.87,86.63 T4.2 | T1.2 325.39,77.74 326.39,78.74 334.01,78.74 335.55,77.2 | 335.55,77.2 T2.2 | 335.55,77.2 343.17,77.2 T3.2 345.71,77.74 346.71,78.74 350.52,78.74 354.6,74.66 T4.2
  Bottom 1.27: ADC.14 259.08,73.66 257.81,72.39 257.81,62.23 259.08,60.96 ADC.9 260.35,46.99 241.3,27.94 U$5.3 227.33,21.59 162.56,21.59 U$4.3 138.43,10.16 120.65,10.16 117.47,13.34 PRSB.1 106.05,13.34 U$3.3
N$1
  Top 1.27: PA.1A 54.53,64.69 57.15,67.31 57.15,68.58 55.88,69.85 38.1,69.85 35.56,72.39 35.56,74.93 34.29,76.2 CCKTA.2
N$2
  Top 1.27: CCKTB.2 88.9,76.2 100.41,64.69 PB.1A
N$3  (via drill 0.38)
  Top 0.254: 282.96,72.39 282.96,78.74 Q6.2 | v325.63,59.44 295.91,59.44 282.96,72.39 | 282.96,72.39 R6.1
  Bottom 0.254: v325.63,59.44 325.63,59.94 326.64,60.96 326.64,68.58 344.68,86.61 344.68,90.93 X2.16
N$4
  Top 1.27: R11.2 R10.1
N$6
  Top 1.27: R8.1 R12.2
N$8
  Top 1.27: PD.1A 177.8,64.84 177.8,73.66 175.26,76.2 CCKTD.2
N$9
  Top 1.27: R14.1 R15.2
N$11
  Top 1.27: PE.1A 241.45,68.43 233.68,76.2 CCKTE.2
N$12
  Top 1.27: R17.1 R18.2
N$14
  Top 0.254: Q6.3 281.94,81.28 277.88,81.28 275.34,83.82 R5.1 275.08,83.82 275.08,83.31 ADC.12
N$15  (via drill 0.38)
  Top 0.254: v343.66,89.15 353.06,89.15 354.84,90.93 X2.8
  Bottom 0.254: v343.66,89.15 327.41,72.9 T1.3
N$16  (via drill 0.38)
  Top 0.254: ADC.13 260.35,70.61 258.57,68.83 258.57,68.33 259.84,67.06 278.13,67.06 292.86,52.32 319.79,52.32 v326.9,59.44
  Bottom 0.254: v326.9,59.44 326.9,60.45 334.26,67.82 334.26,75.44 349.76,90.93 X2.12
N$17  (via drill 0.38)
  Top 0.254: v288.8,86.36 333.76,86.36 337.06,89.66 340.87,89.66 342.14,90.93 X2.18
  Bottom 0.254: ADC.11 260.35,66.55 262.13,68.33 262.13,87.12 261.62,87.63 261.62,94.49 263.4,96.27 278.89,96.27 v288.8,86.36
N$18  (via drill 0.38)
  Top 0.254: v262.64,87.88 277.88,87.88 278.38,87.38 333.5,87.38 337.06,90.93 X2.22
  Bottom 0.254: ADC.10 260.35,64.01 262.64,66.29 v262.64,87.88
N$19
  Bottom 0.254: T2.3 337.57,72.9 352.3,87.63 352.3,90.93 X2.10
N$20  (via drill 0.38)
  Top 0.254: v336.3,87.63 v344.93,78.99
  Bottom 0.254: v344.93,78.99 349,74.93 349,74.17 347.73,72.9 T3.3 | v336.3,87.63 335.53,87.63 332.23,90.93 X2.26
N$21
  Bottom 0.254: T4.3 357.63,72.64 342.39,57.4 322.07,57.4 321.56,57.91 321.56,88.14 324.36,90.93 X2.32
N$22
  Top 1.27: U$4.P1.2 BB+.1
N$23
  Bottom 1.27: U$3.P1.2 BA+.1
N$24
  Top 1.27: U$5.P1.2 BD+.1
N$25
  Top 1.27: U$6.P1.2 BE+.1
RDA
  Bottom 1.27: B1_2.P2.4 59.05,84.45 63.5,80.01 63.5,50.8 R9.2
RDB  (via drill 0.35)
  Top 1.27: B1_2.P4.4 v123.19,85.09
  Bottom 1.27: v123.19,85.09 R7.2
RDD  (via drill 0.35)
  Top 1.27: B3_4.P2.4 200.03,89.53 199.39,88.9 v199.39,85.09
  Bottom 1.27: v199.39,85.09 199.39,55.88 200.66,54.61 R13.2
RDE
  Bottom 1.27: B3_4.P4.4 R16.2
V1  (via drill 0.38)
  Top 0.254: ADC.1 248.92,78.74 v247.4,77.22
  Top 1.27: R10.2 R9.1 54.61,33.02 VSENA.1
  Bottom 0.254: v247.4,77.22 247.4,62.74 240.79,56.13 235.2,56.13 209.8,30.73 202.69,30.73 201.42,32 197.87,32 196.09,30.23 158.24,30.23 156.72,31.75 133.35,31.75 131.32,29.72 123.95,29.72 123.44,29.21 67.31,29.21 66.04,30.48 R10.2
V2  (via drill 0.38)
  Top 0.254: ADC.3 252.73,73.15 240.79,61.21 v239.52,61.21
  Top 1.27: R8.2 R7.1 119.38,33.02 VSENB.1
  Bottom 0.254: v239.52,61.21 209.55,31.24 203.96,31.24 200.91,34.29 135.13,34.29 131.32,30.48 R8.2
V3
  Top 1.27: R14.2 R13.1 199.39,31.75 VSEND.1
  Bottom 0.254: ADC.5 252.73,68.07 250.44,65.79 250.44,44.7 247.4,41.66 222.25,41.66 210.31,29.72 201.42,29.72 R14.2
V4  (via drill 0.38)
  Top 0.254: ADC.7 252.73,62.99 255.78,59.94 255.78,58.67 262.13,52.32 v262.64,52.32
  Top 1.27: R17.2 R16.1 259.08,33.02 VSENE.1
  Bottom 0.254: v262.64,52.32 262.64,34.54 R16.1